# Altium schematic sheet 2xparallelswitch.SchDoc
size B; Author: AM; CompanyName: Expatria Technologies; DrawnBy: A.Marles; Engineer: AM; Organization: Expatria Technologies; DocumentNumber: 6; Revision: A1; SheetNumber: 6; SheetTotal: 14; PCB_Rev: A1
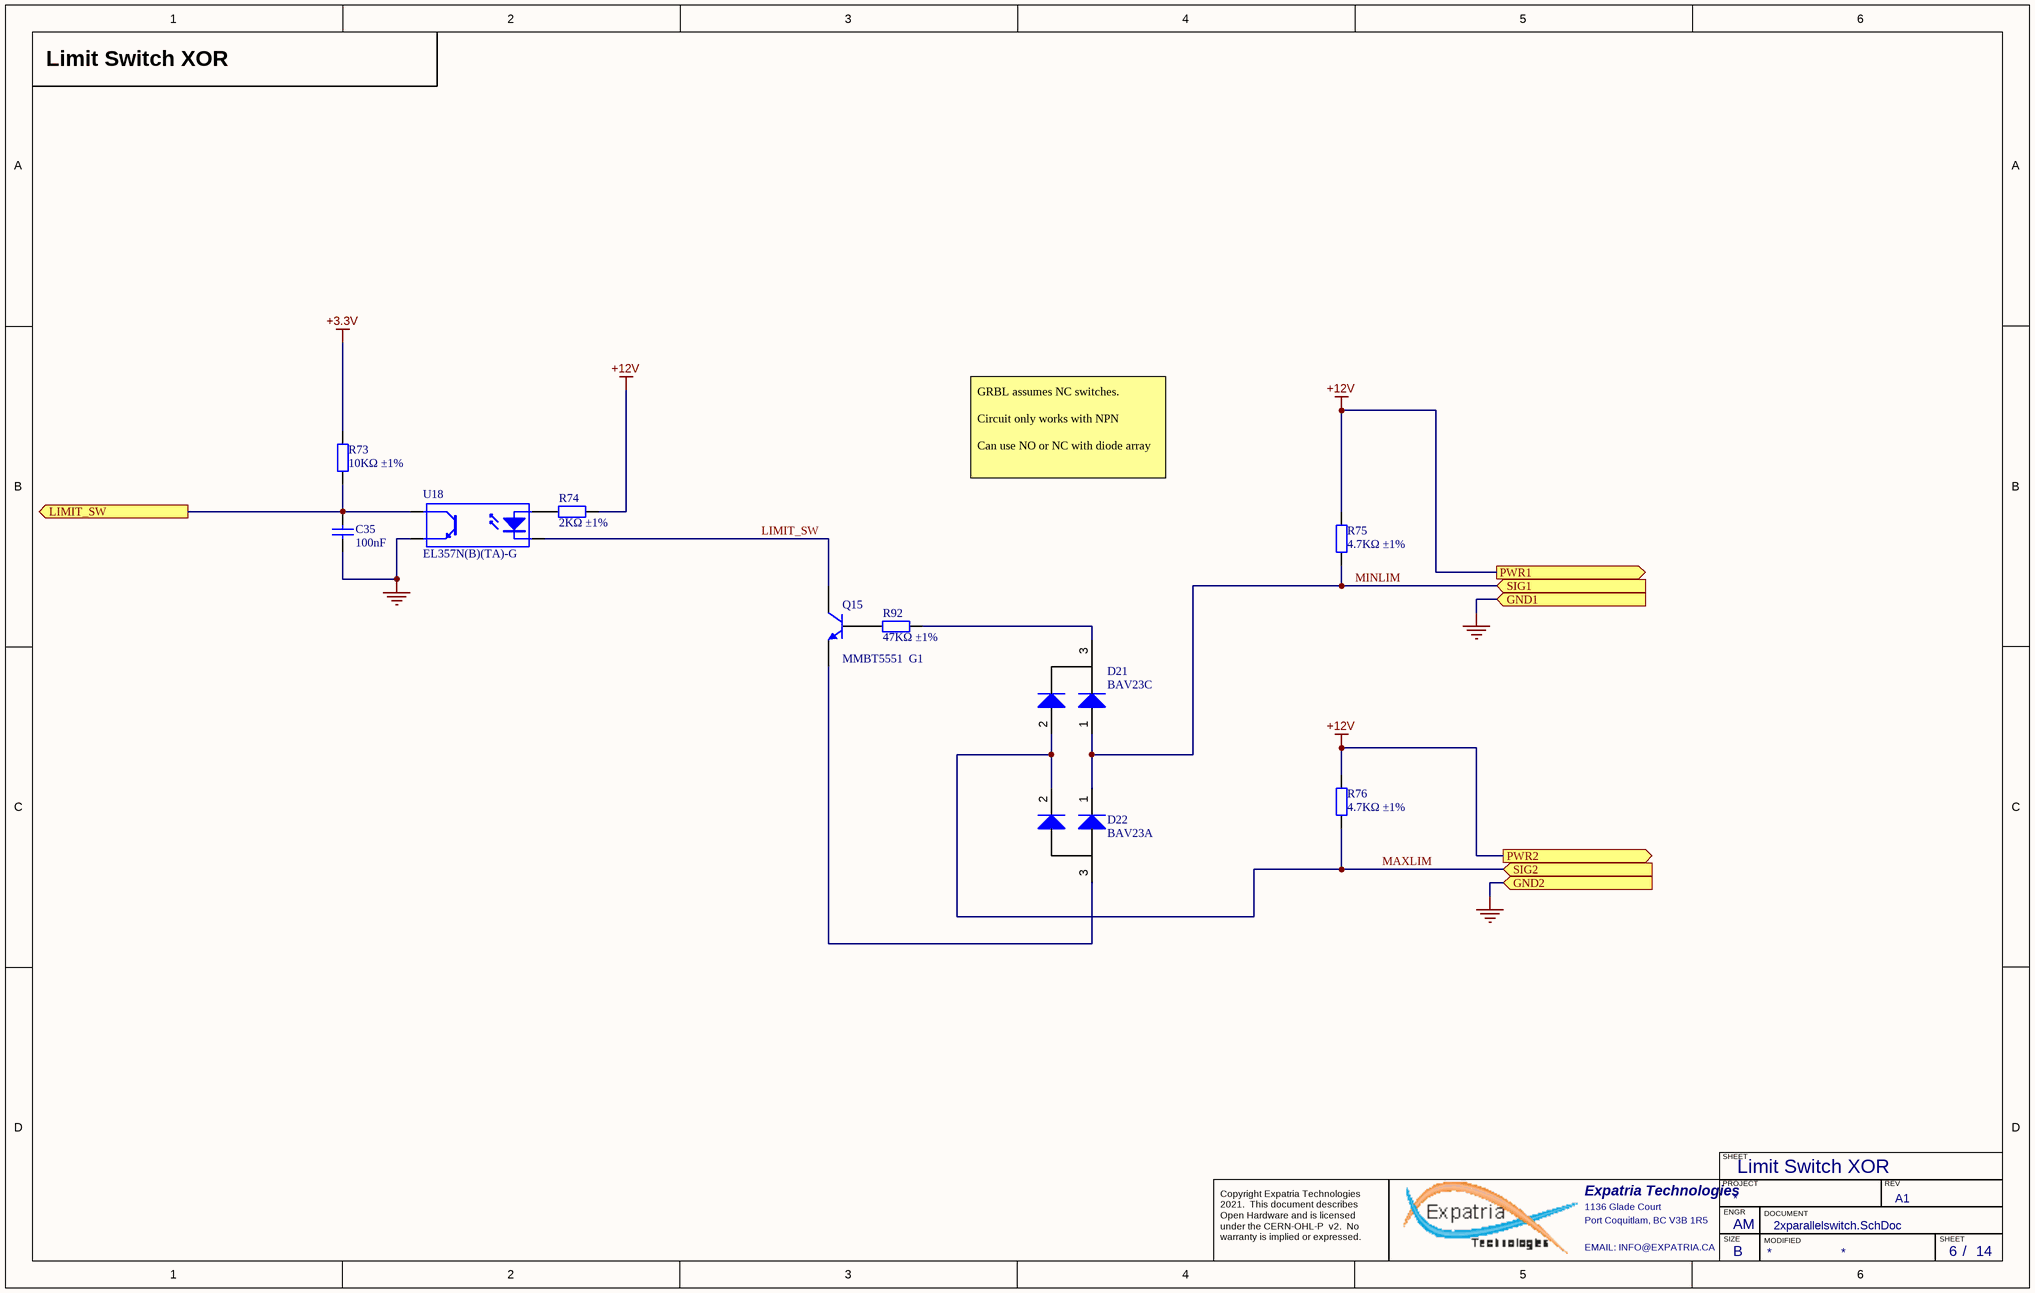
[diagram p0: 2xparallelswitch.SchDoc]

## Parts
C35  100nF  [0402_C]
D21  BAV23C  [SOT-23(SOT-23-3)]
D22  BAV23A  [SOT-23(SOT-23-3)]
Q15  MMBT5551  G1  [SOT-23(SOT-23-3)]
R73  10KΩ ±1%  [0402_R]
R74  2KΩ ±1%  [0402_R]
R75  4.7KΩ ±1%  [0402_R]
R76  4.7KΩ ±1%  [0402_R]
R92  47KΩ ±1%  [0402_R]
U18  EL357N(B)(TA)-G  [SOP-4_P2.54]

## Ports
GND1 (in), GND2 (in), LIMIT_SW (out), PWR1 (out), PWR2 (out), SIG1 (in), SIG2 (in)

## Nets
+3.3V: R73.2
+12V: R74.2 R75.2 R76.2 ; port PWR1, port PWR2
GND: C35.1 U18.3(E) ; port GND1, port GND2
LIMIT_SW: Q15.3(C) U18.2(K)
LIMIT_SW: C35.2 R73.1 U18.4(C) ; port LIMIT_SW  [a separate net that carries the same name]
MAXLIM: D21.2(A) D22.2(K) R76.1 ; port SIG2
MINLIM: D21.1(A) D22.1(K) R75.1 ; port SIG1
NetD21_3: D21.3(K) R92.1
NetD22_3: D22.3(A) Q15.2(E)
NetQ15_1: Q15.1(B) R92.2
NetR74_1: R74.1 U18.1(A)

## Notes on the sheet
- Limit Switch XOR
- GRBL assumes NC switches.
  Circuit only works with NPN
  Can use NO or NC with diode array
- SHEET
- Expatria Technologies
- 1136 Glade Court
- Port Coquitlam, BC V3B 1R5
- PROJECT
- SIZE
- ENGR
- MODIFIED
- DOCUMENT
- REV
- Copyright Expatria Technologies 2021.  This document describes Open Hardware and is licensed under the CERN-OHL-P  v2.  No warranty is implied or expressed.
- EMAIL: INFO@EXPATRIA.CA
- B
- /

## Library data of the parts
C35 = 0402 100nF (104) 10% 16V: Chip capacitors; Manufacturer: Samsung Electro-Mechanics; PartNumber: CL05B104KO5NNNC; Tolerance: 10%; Voltage: 16V; Package: 0402; Supplier: LC; SuppliersPartNumber: C1525; Capacitance: 100nF
D21 = SOT-23 BAV23C: 250V +150℃@(Tj) 350mW Dual Common Cathode 1.25V@200mA 50ns 100nA@250V 225mA SOT-23 Switching Diode ROHS; ComponentLink1Description: 供应商链接; ComponentLink1URL: http://www.szlcsc.com/product/details_70091.html; Package: SOT-23; Supplier: LC; SuppliersPartNumber: C545540
D22 = SOT-23 BAV23A: 200V -65℃~+150℃@(Tj) 350mW 1 Pair Common Anode 1.25V@200mA 50ns 100nA@200V 400mA SOT-23 Switching Diode ROHS; ComponentLink1Description: 供应商链接; ComponentLink1URL: http://www.szlcsc.com/product/details_70091.html; Package: SOT-23; Supplier: LC; SuppliersPartNumber: C328584
Q15 = SOT-23 MMBT5551  G1: 三极管; ComponentLink1Description: 供应商链接; ComponentLink1URL: http://www.szlcsc.com/product/details_2502.html; Package: SOT-23; Supplier: LC; SuppliersPartNumber: C2145
R73 = 0402 10K (1002) 1%: Chip resistor; Manufacturer: Uniroyal Elec; PartNumber: 0402WGF1002TCE; Power: 1/16W; Package: 0402; Supplier: LC; SuppliersPartNumber: C25744; Resistance: 10KΩ; Tolerance: 1%
R74 = 0402 2K (2001) 1%: Chip resistor; Manufacturer: Uniroyal Elec; PartNumber: 0402WGF2001TCE; Power: 1/16W; ComponentLink1Description: Supplier link; ComponentLink1URL: http://www.szlcsc.com/product/details_4516.html; Package: 0402; Supplier: LC; SuppliersPartNumber: C4109; Resistance: 2KΩ; Tolerance: 1%
R75 R76 = 0402 4.7K (4701) 1%: Chip resistor; Manufacturer: Uniroyal Elec; PartNumber: 0402WGF4701TCE; Power: 1/16W; ComponentLink1Description: Supplier link; ComponentLink1URL: http://www.szlcsc.com/product/details_26643.html; Package: 0402; Supplier: LC; SuppliersPartNumber: C25900; Resistance: 4.7KΩ; Tolerance: 1%
R92 = 0402 47K (4702) 1%: Chip resistor; Manufacturer: Uniroyal Elec; PartNumber: 0402WGF4702TCE; Power: 1/16W; ComponentLink1Description: Supplier link; ComponentLink1URL: http://www.szlcsc.com/product/details_26535.html; Package: 0402; Supplier: LC; SuppliersPartNumber: C25792; Resistance: 47KΩ; Tolerance: 1%
U18 = EL357N(B)(TA)-G_[C6649]: 贴片光耦; Package: SOP-4_P2.54; Supplier: LC; SuppliersPartNumber: C6649